# Altium schematic sheet 1.NZPP.SchDoc
size 420 x 297 mm; SheetNumber: 1; SheetTotal: 2
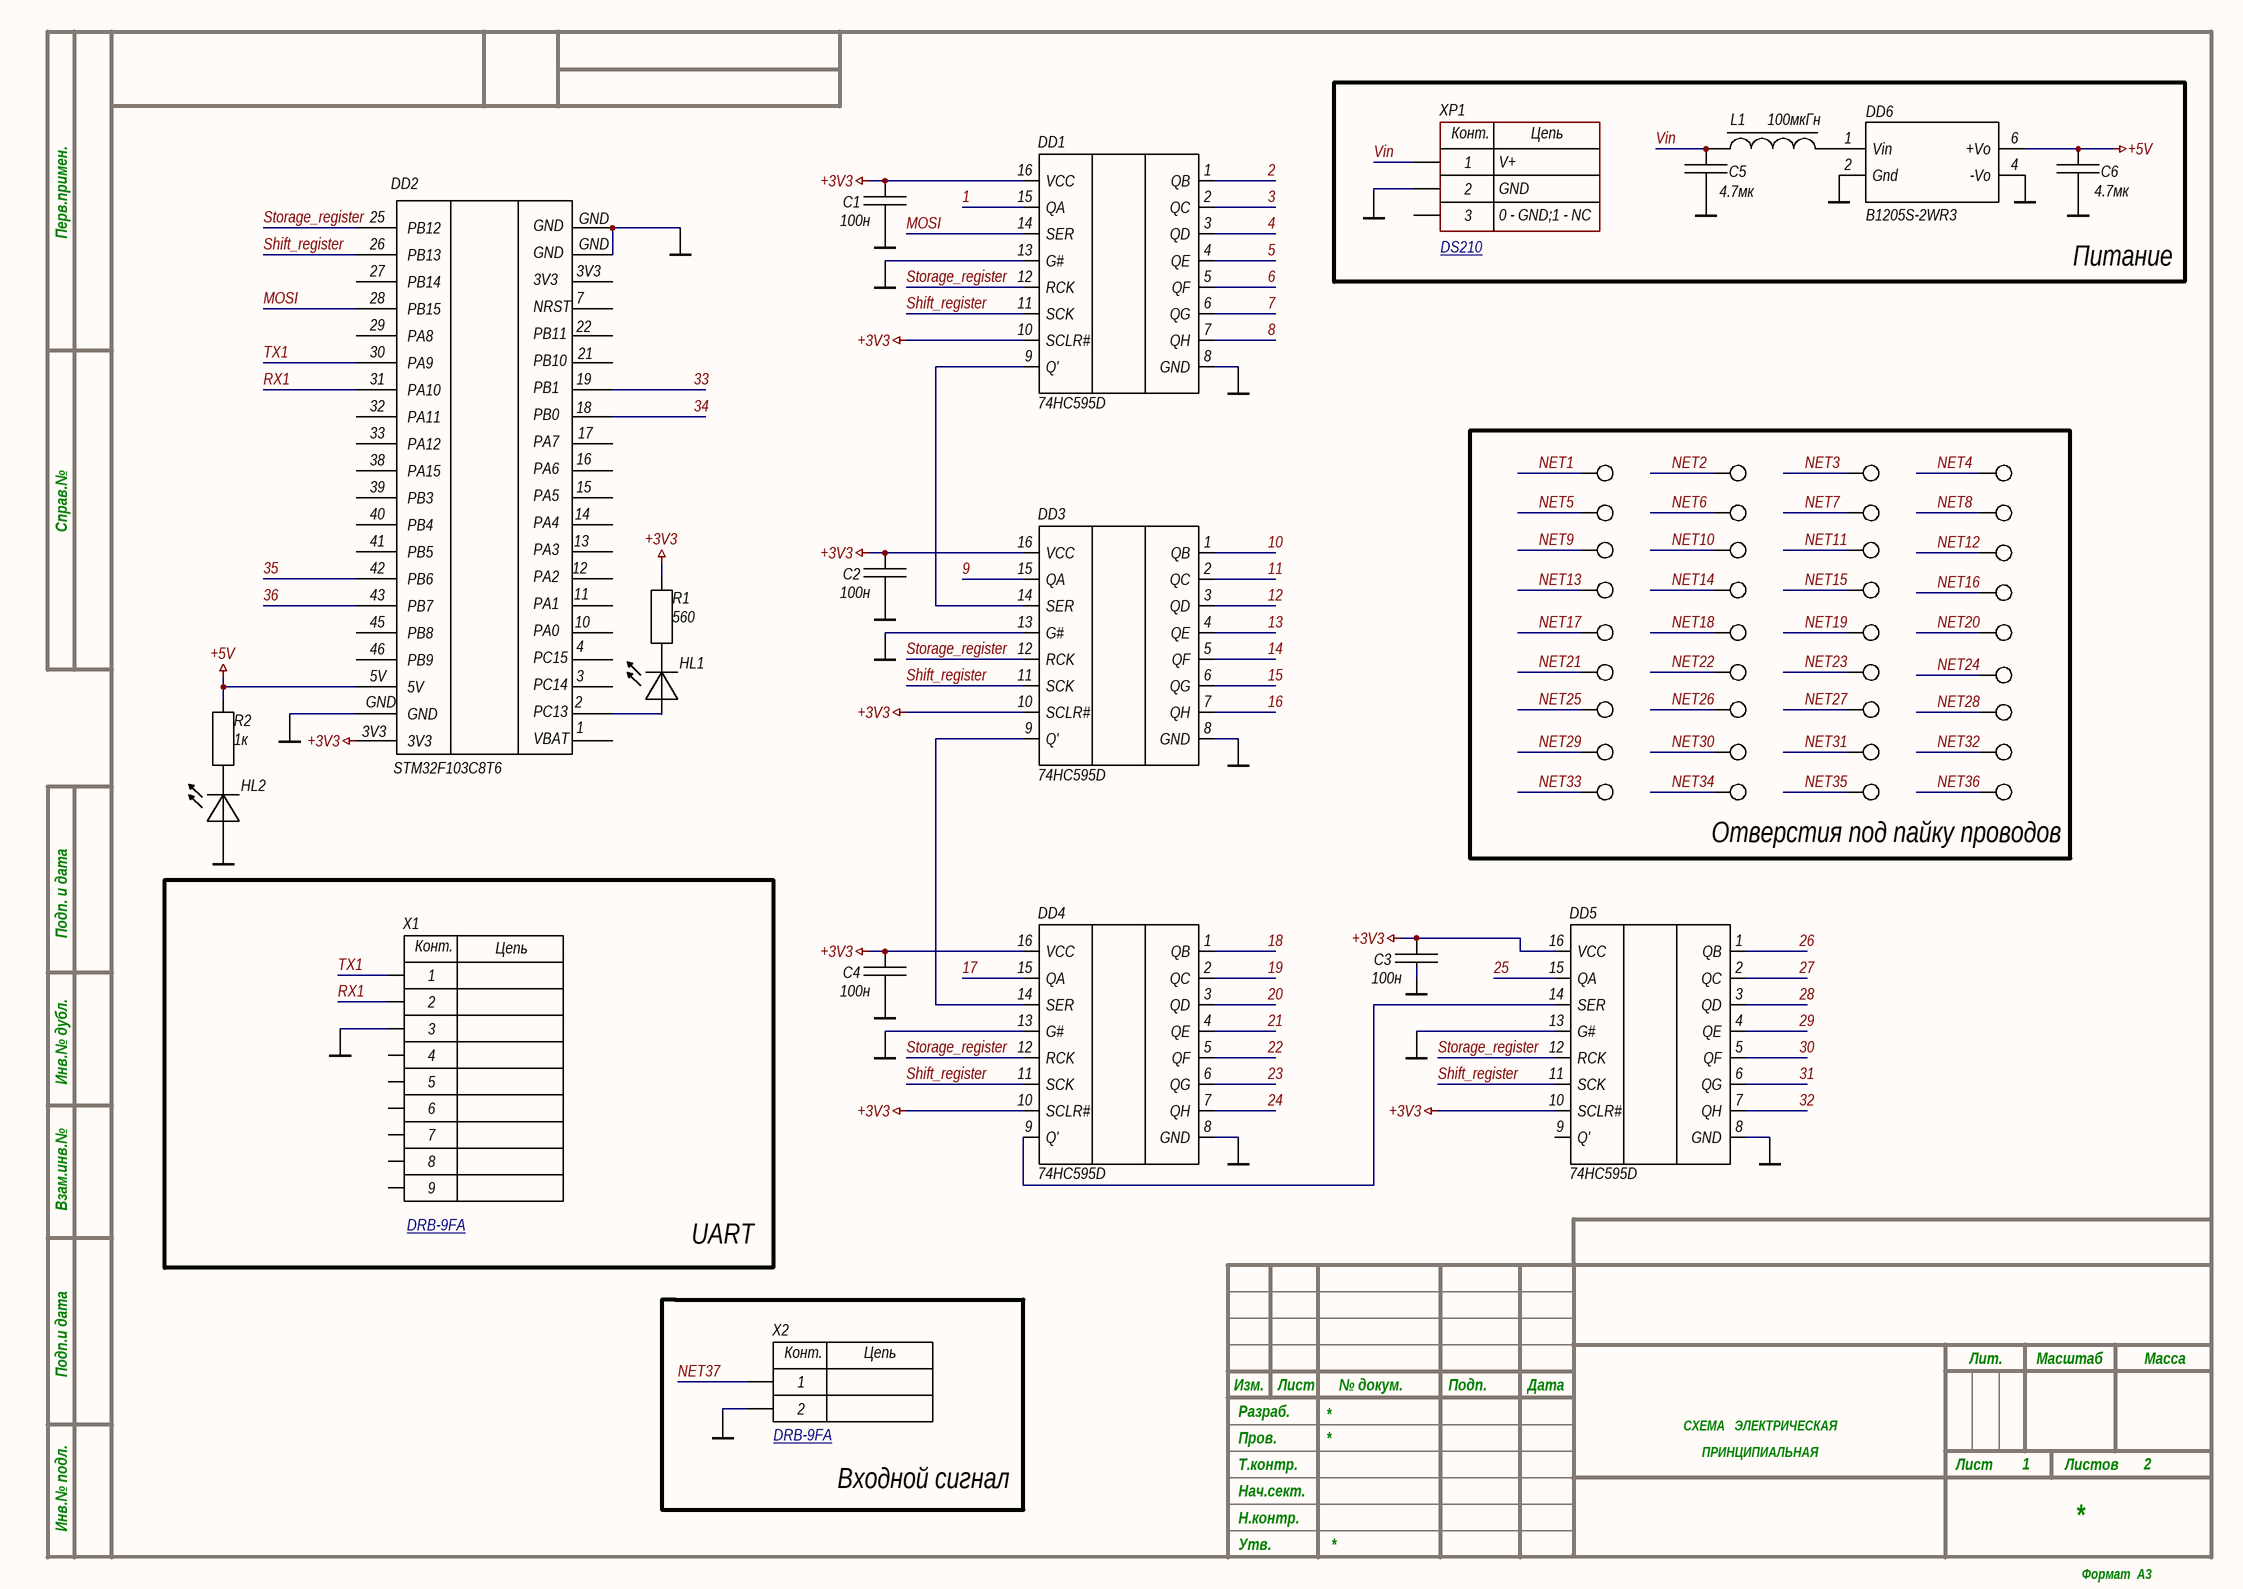
[diagram p0: 1.NZPP.SchDoc]

## Parts
*  Point  [Point]  (value not drawn)
*1  Point  [Point]  (value not drawn)
*2  Point  [Point]  (value not drawn)
*3  Point  [Point]  (value not drawn)
*4  Point  [Point]  (value not drawn)
*5  Point  [Point]  (value not drawn)
*6  Point  [Point]  (value not drawn)
*7  Point  [Point]  (value not drawn)
*8  Point  [Point]  (value not drawn)
*9  Point  [Point]  (value not drawn)
*10  Point  [Point]  (value not drawn)
*11  Point  [Point]  (value not drawn)
*12  Point  [Point]  (value not drawn)
*13  Point  [Point]  (value not drawn)
*14  Point  [Point]  (value not drawn)
*15  Point  [Point]  (value not drawn)
*16  Point  [Point]  (value not drawn)
*17  Point  [Point]  (value not drawn)
*18  Point  [Point]  (value not drawn)
*19  Point  [Point]  (value not drawn)
*20  Point  [Point]  (value not drawn)
*21  Point  [Point]  (value not drawn)
*22  Point  [Point]  (value not drawn)
*23  Point  [Point]  (value not drawn)
*24  Point  [Point]  (value not drawn)
*25  Point  [Point]  (value not drawn)
*26  Point  [Point]  (value not drawn)
*27  Point  [Point]  (value not drawn)
*28  Point  [Point]  (value not drawn)
*29  Point  [Point]  (value not drawn)
*30  Point  [Point]  (value not drawn)
*31  Point  [Point]  (value not drawn)
*32  Point  [Point]  (value not drawn)
*33  Point  [Point]  (value not drawn)
*34  Point  [Point]  (value not drawn)
*35  Point  [Point]  (value not drawn)
C1  100н  [CAP: 0805]
C2  100н  [CAP: 0805]
C3  100н  [CAP: 0805]
C4  100н  [CAP: 0805]
C5  4.7мк  [CAP: 0805]
C6  4.7мк  [CAP: 0805]
DD1  74HC595D  [74HC595D]
DD2  STM32F103C8T6  [STM32F103C8T6 - duplicate]
DD3  74HC595D  [74HC595D]
DD4  74HC595D  [74HC595D]
DD5  74HC595D  [74HC595D]
DD6  B1205S-2WR3  [B1205S-2WR3]
HL1  GNL-3012HD  [led]  (value not drawn)
HL2  GNL-3012HD  [led]  (value not drawn)
L1  100мкГн  [100мкГн]
R1  560  [RES: 0805]
R2  1к  [RES: 0805]
X1  DRB-9FA  [CON: DB-9F]  (value not drawn)
X2  SMA-KWHD  [CON: SMA-KWHD]  (value not drawn)
XP1  DS210  [CON: DS210]  (value not drawn)

## Blocks framed on the sheet
Питание: C5 C6 DD6 L1 XP1
UART: X1
Входной сигнал: X2

## Nets
+3V3: C1.2 C2.2 C3.2 C4.2 DD1.10(SCLR#) DD1.16(VCC) DD2.A2(3V3) DD3.10(SCLR#) DD3.16(VCC) DD4.10(SCLR#) DD4.16(VCC) DD5.10(SCLR#) DD5.16(VCC) R1.2
+5V: C6.2 DD2.5V DD6.6(+Vo) R2.2
GND: C1.1 C2.1 C3.1 C4.1 C5.1 C6.1 DD1.8(GND) DD1.13(G#) DD2.GND DD3.8(GND) DD3.13(G#) DD4.8(GND) DD4.13(G#) DD5.8(GND) DD5.13(G#) DD6.2(Gnd) DD6.4(-Vo) HL2.1(A) X1.3 X2.2 XP1.2
1: DD1.15(QA)
2: DD1.1(QB)
3: DD1.2(QC)
4: DD1.3(QD)
5: DD1.4(QE)
6: DD1.5(QF)
7: DD1.6(QG)
8: DD1.7(QH)
9: DD3.15(QA)
10: DD3.1(QB)
11: DD3.2(QC)
12: DD3.3(QD)
13: DD3.4(QE)
14: DD3.5(QF)
15: DD3.6(QG)
16: DD3.7(QH)
17: DD4.15(QA)
18: DD4.1(QB)
19: DD4.2(QC)
20: DD4.3(QD)
21: DD4.4(QE)
22: DD4.5(QF)
23: DD4.6(QG)
24: DD4.7(QH)
25: DD5.15(QA)
26: DD5.1(QB)
27: DD5.2(QC)
28: DD5.3(QD)
29: DD5.4(QE)
30: DD5.5(QF)
31: DD5.6(QG)
32: DD5.7(QH)
33: DD2.19(PB1)
34: DD2.18(PB0)
35: DD2.42(PB6)
36: DD2.43(PB7)
MOSI: DD1.14(SER) DD2.28(PB15)
NET1: *.1
NET2: *1.1
NET3: *2.1
NET4: *3.1
NET5: *4.1
NET6: *5.1
NET7: *6.1
NET8: *7.1
NET9: *8.1
NET10: *9.1
NET11: *10.1
NET12: *11.1
NET13: *12.1
NET14: *13.1
NET15: *14.1
NET16: *15.1
NET17: *16.1
NET18: *17.1
NET19: *18.1
NET20: *19.1
NET21: *20.1
NET22: *21.1
NET23: *22.1
NET24: *23.1
NET25: *24.1
NET26: *25.1
NET27: *26.1
NET28: *27.1
NET29: *28.1
NET30: *29.1
NET31: *30.1
NET32: *31.1
NET33: *32.1
NET34: *33.1
NET35: *34.1
NET36: *35.1
NET37: X2.1
RX1: DD2.31(PA10) X1.2
Shift_register: DD1.11(SCK) DD2.26(PB13) DD3.11(SCK) DD4.11(SCK) DD5.11(SCK)
Storage_register: DD1.12(RCK) DD2.25(PB12) DD3.12(RCK) DD4.12(RCK) DD5.12(RCK)
TX1: DD2.30(PA9) X1.1
Vin: C5.2 L1.1 XP1.1
NetDD1_9: DD1.9(Q') DD3.14(SER)
NetDD2_2: DD2.2(PC13) HL1.1(A)
NetDD3_9: DD3.9(Q') DD4.14(SER)
NetDD4_9: DD4.9(Q') DD5.14(SER)
NetDD6_1: DD6.1(Vin) L1.2
NetHL1_2: HL1.2(C) R1.1
NetHL2_2: HL2.2(C) R2.1

Not connected (* = marked no-connect by the designer): DD2 1(Vbat) 3(PC14) 4(PC15) 7(NRST) 10(PA0) 11(PA1) 12(PA2) 13(PA3) 14(PA4) 15(PA5) 16(PA6) 17(PA7) 21(PB10) 22(PB11) 27(PB14) 29(PA8) 32(PA11) 33(PA12) 38(PA15) 39(PB3) 40(PB4) 41(PB5) 45(PB8) 46(PB9) A1(3V3); DD5 9(Q'); X1 4 5 6 7 8 9; XP1 3

## Notes on the sheet
- (near XP1) DS210 <https://www.chipdip.ru/product/ds-210b-gnezdo-pitaniya-2-1x5-5mm-na-panel-dragon-city-463130296>
- Отверстия под пайку проводов
- (near X1) DRB-9FA <https://www.chipdip.ru/product/drb-9fa-ds1037-9f-rozetka-9-pin-na-platu-7.2mm-connfly-35208>
- (near X2) DRB-9FA <https://www.chipdip.ru/product/drb-9fa-ds1037-9f-rozetka-9-pin-na-platu-7.2mm-connfly-35208>
- Перв.примен.
- Справ.№
- Подп. и дата
- Инв.№ дубл.
- Взам.инв.№
- Подп.и дата
- Разраб.
- Изм.
- Лист
- № докум.
- Подп.
- Дата
- Лит.
- Масштаб
- Масса
- Т.контр.
- Пров.
- СХЕМА   ЭЛЕКТРИЧЕСКАЯ
- ПРИНЦИПИАЛЬНАЯ
- Листов
- Инв.№ подл.
- Утв.
- Н.контр.
- Нач.сект.
- Формат  A3
- (in symbol Connector_terminal_2pin) Конт.; Цепь
- (in symbol DRB-9FA) Конт.; Цепь
- (in symbol DS210) Конт.; Цепь; V+; GND; 0 - GND;1 - NC
- (in symbol STM32F103) VBAT

## Library data of the parts
C1-C6 = Ceramic_0805: Наименование: 0805 10мкФ X7R 10%; Примечание: SMD
DD2 = STM32F103
HL1 HL2 = LED
L1 = Дроссель 100мкГн CD43-101K
R1 R2 = Resistor_0805: Наименование: 0805 100кОм; Примечание: SMD
X2 = Connector_terminal_2pin: Наименование: DG350-3.5-02P-14
X1 = DRB-9FA: Наименование: DRB-9FA
XP1 = DS210: Valuerus: DS210; Value: DS210